# Altium schematic sheet XmasLights.SchDoc
size A4
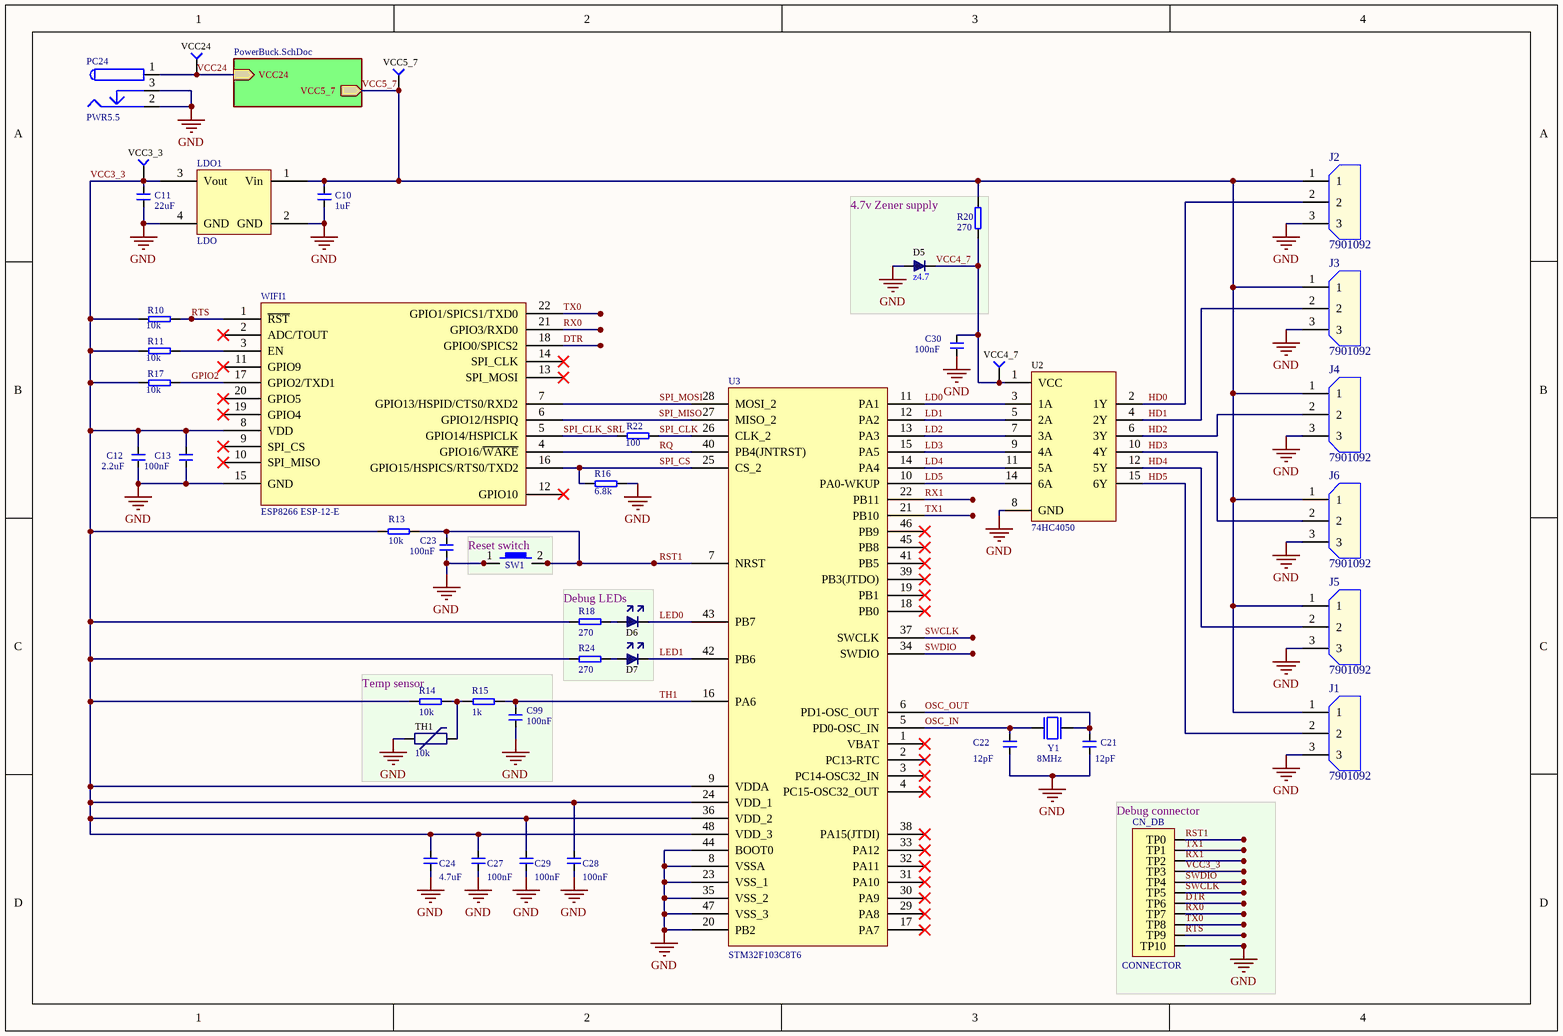
[diagram p0: XmasLights.SchDoc]

## Parts
C10  1uF  [CAP_1206]
C11  22uF  [CAP_1206]
C12  2.2uF  [CAP 0603/1608]
C13  100nF  [CAP 0603/1608]
C21  12pF  [CAP 0603/1608]
C22  12pF  [CAP 0603/1608]
C23  100nF  [CAP 0603/1608]
C24  4.7uF  [CAP 0603/1608]
C27  100nF  [CAP 0603/1608]
C28  100nF  [CAP 0603/1608]
C29  100nF  [CAP 0603/1608]
C30  100nF  [CAP 0603/1608]
C99  100nF  [CAP 0603/1608]
CN_DB  CONNECTOR  [Edge Connector]  (no BOM)
D5  z4.7  [SOD2512X110N]
D6  LED  [Chip2PinSM127P600-8N]  (value not drawn)
D7  LED  [Chip2PinSM127P600-8N]  (value not drawn)
J1  7901092  [7901092]
J2  7901092  [7901092]
J3  7901092  [7901092]
J4  7901092  [7901092]
J5  7901092  [7901092]
J6  7901092  [7901092]
LDO1  LDO  [SOT230P700X180-4N]
PC24  PWR5.5  [DC_CON]
R10  10k  [RES 0603/1608]
R11  10k  [RES 0603/1608]
R13  10k  [RES 0603/1608]
R14  10k  [RES 0603/1608]
R15  1k  [RES 0603/1608]
R16  6.8k  [RES 0603/1608]
R17  10k  [RES 0603/1608]
R18  270  [RES 0603/1608]
R20  270  [RES 0603/1608]
R22  100  [RES 0603/1608]
R24  270  [RES 0603/1608]
SW1  SWITCH  [FSM-SWITCH]  (value not drawn)
TH1  10k  [CAP 0603/1608]
U2  74HC4050  [SOIC127P600X175-16N]
U3  STM32F103C8T6  [CQFP50P900X900X160-48N]
VCC3_3  TESTPOINT  [TESTPOINT]  (value not drawn)  (no BOM)
VCC4_7  TESTPOINT  [TESTPOINT]  (value not drawn)  (no BOM)
VCC5_7  TESTPOINT  [TESTPOINT]  (value not drawn)  (no BOM)
VCC24  TESTPOINT  [TESTPOINT]  (value not drawn)  (no BOM)
WIFI1  ESP8266 ESP-12-E  [ESP8266 ESP-12-E]
Y1  8MHz  [CRYSTAL]

## Sub-sheets
? = PowerBuck.SchDoc: VCC5_7 (out), VCC24 (in)

## Nets
GND: C10.2 C11.2 C12.2 C13.2 C21.1 C22.1 C23.2 C24.2 C27.2 C28.2 C29.2 C30.2 C99.1 CN_DB.11(TP10) D5.1(C) J1.3 J2.3 J3.3 J4.3 J5.3 J6.3 LDO1.2(GND) LDO1.4(GND) PC24.2 PC24.3 R16.1 SW1.1 SW1.3 TH1.1(A) U2.8(GND) U3.8(VSSA) U3.20(PB2) U3.23(VSS_1) U3.35(VSS_2) U3.44(BOOT0) U3.47(VSS_3) WIFI1.15(GND)
DTR: CN_DB.7(TP6) WIFI1.18(GPIO0/SPICS2)
GPIO2: R17.2 WIFI1.17(GPIO2/TXD1)
HD0: J2.2 U2.2(1Y)
HD1: J3.2 U2.4(2Y)
HD2: J4.2 U2.6(3Y)
HD3: J6.2 U2.10(4Y)
HD4: J5.2 U2.12(5Y)
HD5: J1.2 U2.15(6Y)
LD0: U2.3(1A) U3.11(PA1)
LD1: U2.5(2A) U3.12(PA2)
LD2: U2.7(3A) U3.13(PA3)
LD3: U2.9(4A) U3.15(PA5)
LD4: U2.11(5A) U3.14(PA4)
LD5: U2.14(6A) U3.10(PA0-WKUP)
LED0: D6.2(ANODE) U3.43(PB7)
LED1: D7.2(ANODE) U3.42(PB6)
OSC_IN: C22.2 U3.5(PD0-OSC_IN) Y1.1
OSC_OUT: C21.2 U3.6(PD1-OSC_OUT) Y1.2
RQ: U3.40(PB4(JNTRST)) WIFI1.4(GPIO16/~{WAKE})
RST1: C23.1 CN_DB.1(TP0) R13.2 SW1.2 SW1.4 U3.7(NRST)
RTS: CN_DB.10(TP9) R10.2 WIFI1.1(~{RST})
RX0: CN_DB.8(TP7) WIFI1.21(GPIO3/RXD0)
RX1: CN_DB.3(TP2) U3.22(PB11)
SPI_CLK: R22.2 U3.26(CLK_2)
SPI_CLK_SRL: R22.1 WIFI1.5(GPIO14/HSPICLK)
SPI_CS: R16.2 U3.25(CS_2) WIFI1.16(GPIO15/HSPICS/RTS0/TXD2)
SPI_MISO: U3.27(MISO_2) WIFI1.6(GPIO12/HSPIQ)
SPI_MOSI: U3.28(MOSI_2) WIFI1.7(GPIO13/HSPID/CTS0/RXD2)
SWCLK: CN_DB.6(TP5) U3.37(SWCLK)
SWDIO: CN_DB.5(TP4) U3.34(SWDIO)
TH1: C99.2 R15.1 U3.16(PA6)
TX0: CN_DB.9(TP8) WIFI1.22(GPIO1/SPICS1/TXD0)
TX1: CN_DB.2(TP1) U3.21(PB10)
VCC3_3: C11.1 C12.1 C13.1 C24.1 C27.1 C28.1 C29.1 CN_DB.4(TP3) LDO1.3(Vout) R10.1 R11.1 R13.1 R14.1 R17.1 R18.1 R24.1 U3.9(VDDA) U3.24(VDD_1) U3.36(VDD_2) U3.48(VDD_3) VCC3_3.1 WIFI1.8(VDD)
VCC4_7: C30.1 D5.2(A) R20.1 U2.1(VCC) VCC4_7.1
VCC5_7: C10.1 J1.1 J2.1 J3.1 J4.1 J5.1 J6.1 LDO1.1(Vin) R20.2 VCC5_7.1 ; sheet /VCC5_7
VCC24: PC24.1 VCC24.1 ; sheet /VCC24
NetD6_1: D6.1(CATHODE) R18.2
NetD7_1: D7.1(CATHODE) R24.2
NetR11_2: R11.2 WIFI1.3(EN)
NetR14_2: R14.2 R15.2 TH1.2(A)

Not connected (* = marked no-connect by the designer): U3 1(VBAT)* 2(PC13-RTC)* 3(PC14-OSC32_IN)* 4(PC15-OSC32_OUT)* 17(PA7)* 18(PB0)* 19(PB1)* 29(PA8)* 30(PA9)* 31(PA10)* 32(PA11)* 33(PA12)* 38(PA15(JTDI))* 39(PB3(JTDO))* 41(PB5)* 45(PB8)* 46(PB9)*; WIFI1 2(ADC/TOUT)* 9(SPI_CS)* 10(SPI_MISO)* 11(GPIO9)* 12(GPIO10)* 13(SPI_MOSI)* 14(SPI_CLK)* 19(GPIO4)* 20(GPIO5)*

## Notes on the sheet
- 4.7v Zener supply
- (near SW1) Reset switch
- Debug LEDs
- Temp sensor
- (near CN_DB) Debug connector

## Library data of the parts
C10-C13 C21-C24 C27-C30 C99 = CAP: Capacitor; Note: *; Desc: *
  C10: Value: 1uF
  C11: Value: 22uF
  C12: Value: 2.2uF
  C13 C23 C27-C30 C99: Value: 100nF
  C21 C22: Value: 12pF
  C24: Value: 4.7uF
CN_DB = CONNECTOR: Debug Connector
D5 = DIODE: Value: z4.7
J1-J6 = 7901092: 3 way PCB terminal block 2.54mm RS Pro 2.54mm Pitch Straight PCB Terminal Block with Screw Termination, Through Hole, 3 Way; Manufacturer_Name: RS Components; Allied_Number: 70653463; RS Part Number: 7901092; Manufacturer_Part_Number: 7901092; Datasheet Link: http://uk.rs-online.com/web/p/products/7901092
LDO1 = LDO: LDO Voltage Regulator
PC24 = PWR2.5: Low Voltage Power Supply Connector; Published: 17-Dec-2003; DatasheetDocument: 09-May-2002; Publisher: Altium Limited; ComponentLink1Description: Manufacturer Link; ComponentLink1URL: http://domino.kycon.com/internet/Products.html
R10 R11 R13-R18 R20 R22 R24 = RES: Resistor; Note: *; Desc: *
  R10 R11 R13 R14 R17: Value: 10k
  R15: Value: 1k
  R16: Value: 6.8k
  R18 R20 R24: Value: 270
  R22: Value: 100
SW1 = 4-1437565-1: 6x6mm SMD tactile switch,5mm H 1.6N Black Button Tactile Switch, SPST-NO 0.05 A@ 12 V dc 1.4mm; Manufacturer_Name: TE Connectivity; Allied_Number: R1117787; RS Part Number: 1616046; Manufacturer_Part_Number: 4-1437565-1; Datasheet Link: http://uk.rs-online.com/web/p/products/1616046
TH1 = THERMISTOR: Value: 10k
U3 = STM32F103C8T6: Medium-density performance line ARM-based 32-bit MCU with 64 or 128 KB Flash, USB, CAN, 7 timers, 2 ADCs, 9 com. interfaces
Y1 = CRYSTAL: Cheapo SMT Crystal; Value: 8MHz